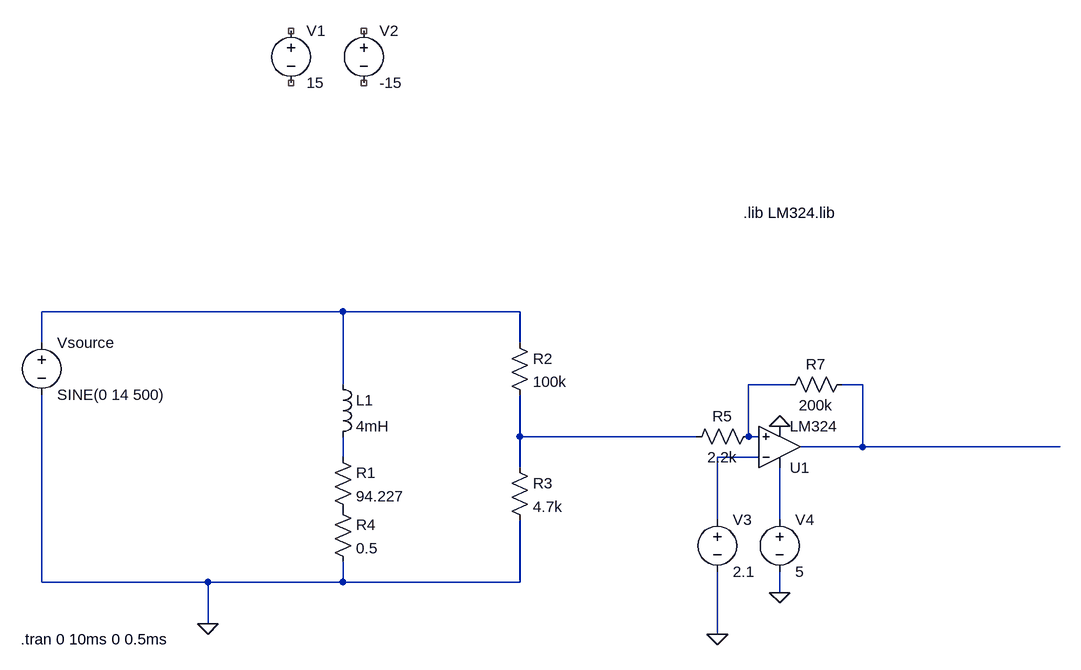
[diagram p0: schematic Vsense.asc]
Vsense.asc, the LTspice schematic file:
Version 4.1
SHEET 1 1412 792
WIRE 304 272 -160 272
WIRE 576 272 304 272
WIRE -160 320 -160 272
WIRE 576 320 576 272
WIRE 304 384 304 272
WIRE 992 384 928 384
WIRE 1104 384 1072 384
WIRE 576 464 576 400
WIRE 848 464 576 464
WIRE 928 464 928 384
WIRE 944 464 928 464
WIRE 1104 480 1104 384
WIRE 1104 480 1008 480
WIRE 1408 480 1104 480
WIRE 304 496 304 464
WIRE 944 496 880 496
WIRE 576 512 576 464
WIRE 880 592 880 496
WIRE 976 592 976 512
WIRE -160 688 -160 400
WIRE 96 688 -160 688
WIRE 304 688 304 656
WIRE 304 688 96 688
WIRE 576 688 576 592
WIRE 576 688 304 688
WIRE 976 704 976 672
WIRE 96 752 96 688
WIRE 880 768 880 672
FLAG 96 752 0
FLAG 880 768 0
FLAG 976 448 0
FLAG 976 704 0
SYMBOL voltage -160 304 R0
WINDOW 123 0 0 Left 0
WINDOW 39 0 0 Left 0
SYMATTR InstName Vsource
SYMATTR Value SINE(0 14 500)
SYMBOL ind 288 368 R0
SYMATTR InstName L1
SYMATTR Value 4mH
SYMATTR SpiceLine Rser=1m
SYMBOL res 288 480 R0
SYMATTR InstName R1
SYMATTR Value 94.227
SYMBOL res 560 304 R0
SYMATTR InstName R2
SYMATTR Value 100k
SYMBOL res 560 496 R0
SYMATTR InstName R3
SYMATTR Value 4.7k
SYMBOL res 288 560 R0
SYMATTR InstName R4
SYMATTR Value 0.5
SYMBOL OpAmps\\opamp2 976 544 M180
SYMATTR InstName U1
SYMATTR Value LM324
SYMBOL voltage 224 -176 R0
WINDOW 123 0 0 Left 0
WINDOW 39 0 0 Left 0
SYMATTR InstName V1
SYMATTR Value 15
SYMBOL voltage 336 -176 R0
WINDOW 123 0 0 Left 0
WINDOW 39 0 0 Left 0
SYMATTR InstName V2
SYMATTR Value -15
SYMBOL res 944 448 R90
WINDOW 0 0 56 VBottom 2
WINDOW 3 32 56 VTop 2
SYMATTR InstName R5
SYMATTR Value 2.2k
SYMBOL res 1088 368 R90
WINDOW 0 0 56 VBottom 2
WINDOW 3 32 56 VTop 2
SYMATTR InstName R7
SYMATTR Value 200k
SYMBOL voltage 880 576 R0
WINDOW 123 0 0 Left 0
WINDOW 39 0 0 Left 0
SYMATTR InstName V3
SYMATTR Value 2.1
SYMBOL voltage 976 576 R0
WINDOW 123 0 0 Left 0
WINDOW 39 0 0 Left 0
SYMATTR InstName V4
SYMATTR Value 5
TEXT -192 776 Left 2 !.tran 0 10ms 0 0.5ms
TEXT 920 120 Left 2 !.lib LM324.lib

The netlist it stands for:
* Vsense.asc
Vsource N001 0 SINE(0 14 500)
L1 N001 N005 4mH Rser=1m
R1 N005 P001 94.227
R2 N001 N004 100k
R3 N004 0 4.7k
R4 P001 0 0.5
X§U1 N002 N006 N007 0 N003 LM324  ; pins In+ In- V+ V- OUT
V1 NC_01 NC_02 15
V2 NC_03 NC_04 -15
R5 N002 N004 2.2k
R7 N003 N002 200k
V3 N006 0 2.1
V4 N007 0 5
.tran 0 10ms 0 0.5ms
.lib LM324.lib
.backanno
.end